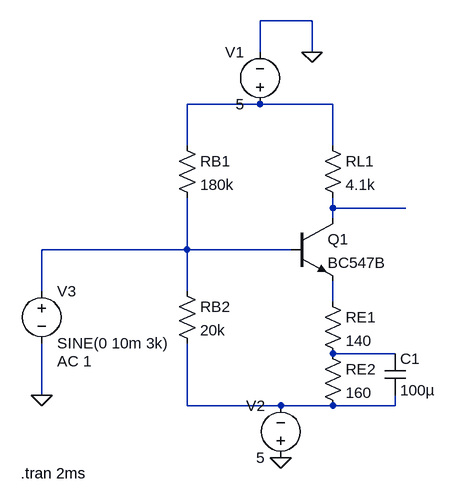
[diagram p0: schematic stage2_ce_amp.asc]
stage2_ce_amp.asc, the LTspice schematic file:
Version 4
SHEET 1 880 680
WIRE 304 -112 224 -112
WIRE 224 -64 224 -112
WIRE 304 -64 304 -112
WIRE 224 16 112 16
WIRE 336 16 224 16
WIRE 112 80 112 16
WIRE 336 80 336 16
WIRE 336 176 336 160
WIRE 448 176 336 176
WIRE 336 192 336 176
WIRE 112 240 112 160
WIRE 112 240 -112 240
WIRE 272 240 112 240
WIRE -112 304 -112 240
WIRE 112 304 112 240
WIRE 336 320 336 288
WIRE 432 400 336 400
WIRE -112 464 -112 384
WIRE 112 480 112 384
WIRE 256 480 112 480
WIRE 336 480 256 480
WIRE 432 480 432 464
WIRE 432 480 336 480
FLAG 304 -64 0
FLAG 256 560 0
FLAG -112 464 0
SYMBOL res 96 64 R0
SYMATTR InstName RB1
SYMATTR Value 180k
SYMBOL res 320 64 R0
SYMATTR InstName RL1
SYMATTR Value 4.1k
SYMBOL npn 272 192 R0
SYMATTR InstName Q1
SYMATTR Value BC547B
SYMBOL res 96 288 R0
SYMATTR InstName RB2
SYMATTR Value 20k
SYMBOL voltage 224 32 R180
WINDOW 0 24 96 Left 2
WINDOW 3 24 16 Left 2
WINDOW 123 0 0 Left 0
WINDOW 39 0 0 Left 0
SYMATTR InstName V1
SYMATTR Value 5
SYMBOL res 320 304 R0
SYMATTR InstName RE1
SYMATTR Value 140
SYMBOL cap 416 400 R0
SYMATTR InstName C1
SYMATTR Value 100µ
SYMBOL res 320 384 R0
SYMATTR InstName RE2
SYMATTR Value 160
SYMBOL voltage 256 576 R180
WINDOW 0 24 96 Left 2
WINDOW 3 24 16 Left 2
WINDOW 123 0 0 Left 0
WINDOW 39 0 0 Left 0
SYMATTR InstName V2
SYMATTR Value 5
SYMBOL voltage -112 288 R0
WINDOW 123 24 124 Left 2
WINDOW 39 0 0 Left 0
SYMATTR Value2 AC 1
SYMATTR InstName V3
SYMATTR Value SINE(0 10m 3k)
TEXT -144 584 Left 2 !.tran 2ms

The netlist it stands for:
* stage2_ce_amp.asc
RB1 N001 N003 180k
RL1 N001 N002 4.1k
Q1 N002 N003 N004 0 BC547B
RB2 N003 N006 20k
V1 N001 0 5
RE1 N004 N005 140
C1 N005 N006 100µ
RE2 N005 N006 160
V2 0 N006 5
V3 N003 0 SINE(0 10m 3k) AC 1
.model NPN NPN
.model PNP PNP
.lib standard.bjt
.tran 2ms
.backanno
.end